# Altium schematic sheet STMF1.SchDoc
size A; SheetNumber: 2; SheetTotal: 9
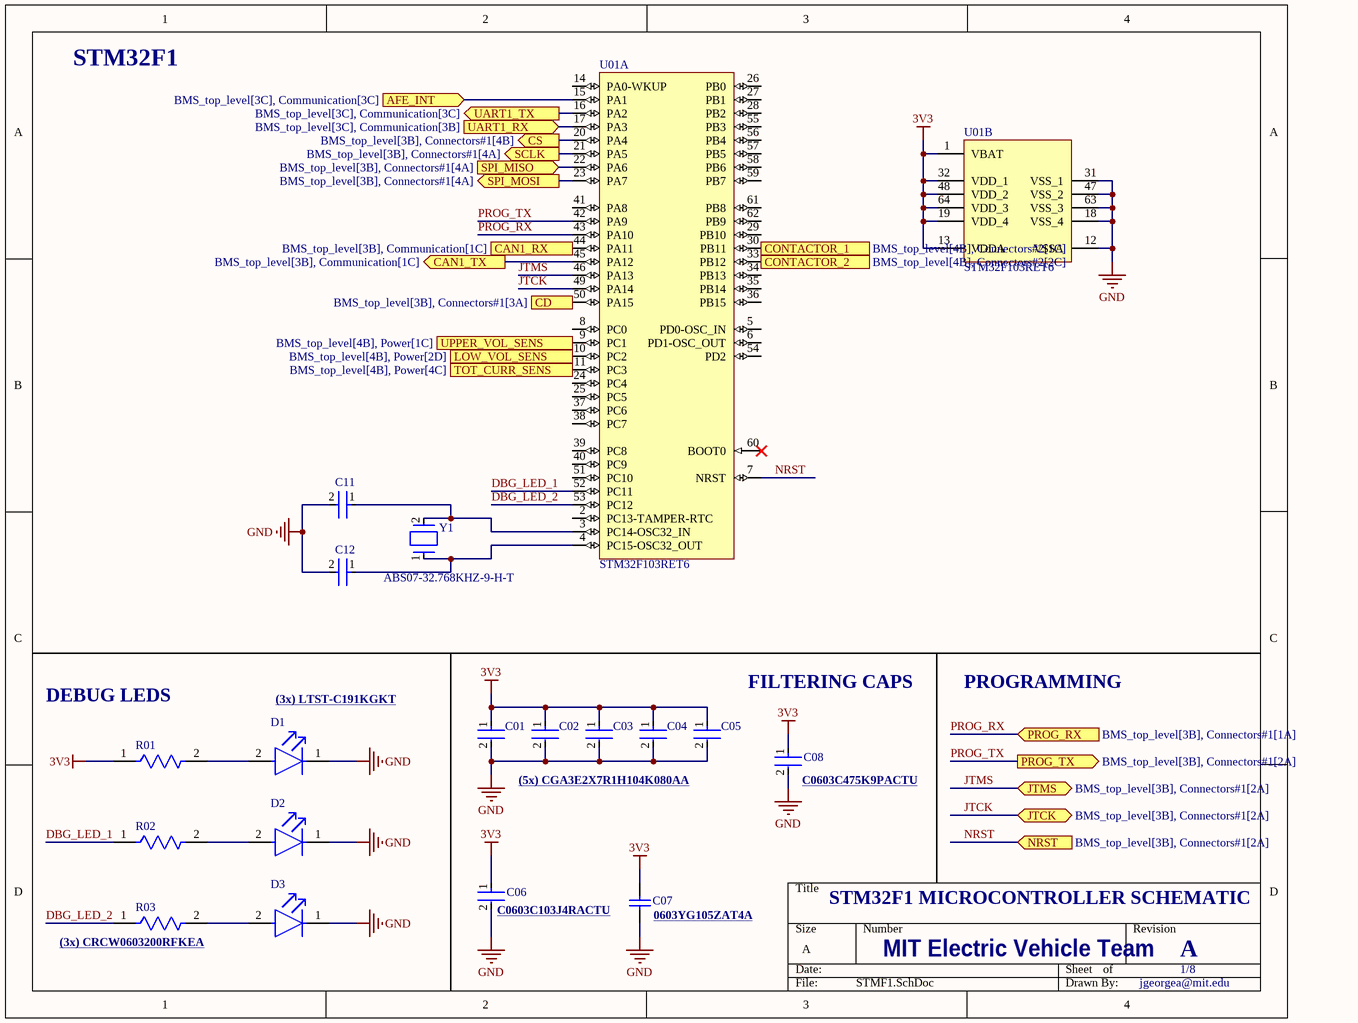
[diagram p0: STMF1.SchDoc]

## Parts
C01  CGA3E2X7R1H104K080AA  [FP-CGA3E-0_3-0_1-IPC_A]  (value not drawn)
C02  CGA3E2X7R1H104K080AA  [FP-CGA3E-0_3-0_1-IPC_A]  (value not drawn)
C03  CGA3E2X7R1H104K080AA  [FP-CGA3E-0_3-0_1-IPC_A]  (value not drawn)
C04  CGA3E2X7R1H104K080AA  [FP-CGA3E-0_3-0_1-IPC_A]  (value not drawn)
C05  CGA3E2X7R1H104K080AA  [FP-CGA3E-0_3-0_1-IPC_A]  (value not drawn)
C06  C0603C103J4RACTU  [FP-C0603C-CF-MFG]  (value not drawn)
C07  0603YG105ZAT4A  [CAPC1608X90X35ML15T15]  (value not drawn)
C08  C0603C475K9PACTU  [FP-C0603-CG-MFG]  (value not drawn)
C11  CBR06C409A1GAC  [FP-CBR06C-MFG]  (value not drawn)
C12  CBR06C409A1GAC  [FP-CBR06C-MFG]  (value not drawn)
D1  LTST-C191KGKT  [FP-LTST-C191KGKT-MFG]  (value not drawn)
D2  LTST-C191KGKT  [FP-LTST-C191KGKT-MFG]  (value not drawn)
D3  LTST-C191KGKT  [FP-LTST-C191KGKT-MFG]  (value not drawn)
R01  CRCW0603200RFKEA  [FP-CRCW0603-e3-MFG]  (value not drawn)
R02  CRCW0603200RFKEA  [FP-CRCW0603-e3-MFG]  (value not drawn)
R03  CRCW0603200RFKEA  [FP-CRCW0603-e3-MFG]  (value not drawn)
U01  STM32F103RET6  [STM-LQFP64_L]  (parts A,B of 2)
Y1  ABS07-32.768KHZ-9-H-T  [FP-ABS07-MFG]

## Ports
AFE_INT (in, see BMS_top_level[3C], Communication[3C]), CAN1_RX (in, see BMS_top_level[3B], Communication[1C]), CAN1_TX (out, see BMS_top_level[3B], Communication[1C]), CD (in, see BMS_top_level[3B], Connectors#1[3A]), CONTACTOR_1 (see BMS_top_level[4B], Connectors#2[1C]), CONTACTOR_2 (see BMS_top_level[4B], Connectors#2[2C]), CS (out, see BMS_top_level[3B], Connectors#1[4B]), JTCK (bidir, see BMS_top_level[3B], Connectors#1[2A]), JTMS (bidir, see BMS_top_level[3B], Connectors#1[2A]), LOW_VOL_SENS (in, see BMS_top_level[4B], Power[2D]), NRST (in, see BMS_top_level[3B], Connectors#1[2A]), PROG_RX (in, see BMS_top_level[3B], Connectors#1[1A]), PROG_TX (out, see BMS_top_level[3B], Connectors#1[2A]), SCLK (out, see BMS_top_level[3B], Connectors#1[4A]), SPI_MISO (in, see BMS_top_level[3B], Connectors#1[4A]), SPI_MOSI (out, see BMS_top_level[3B], Connectors#1[4A]), TOT_CURR_SENS (in, see BMS_top_level[4B], Power[4C]), UART1_RX (in, see BMS_top_level[3C], Communication[3B]), UART1_TX (out, see BMS_top_level[3C], Communication[3C]), UPPER_VOL_SENS (in, see BMS_top_level[4B], Power[1C])

## Nets
3V3: C01.1 C02.1 C03.1 C04.1 C05.1 C06.1 C07.2 C08.1 R01.1 U01.1(VBAT) U01.13(VDDA) U01.19(VDD_4) U01.32(VDD_1) U01.48(VDD_2) U01.64(VDD_3)
GND: C01.2 C02.2 C03.2 C04.2 C05.2 C06.2 C07.1 C08.2 C11.2 C12.2 D1.1(C) D2.1(C) D3.1(C) U01.12(VSSA) U01.18(VSS_4) U01.31(VSS_1) U01.47(VSS_2) U01.63(VSS_3)
AFE_INT: U01.15(PA1) ; port AFE_INT
CAN1_RX: U01.44(PA11) ; port CAN1_RX
CAN1_TX: U01.45(PA12) ; port CAN1_TX
CD: U01.50(PA15) ; port CD
CONTACTOR_1: U01.30(PB11) ; port CONTACTOR_1
CONTACTOR_2: U01.33(PB12) ; port CONTACTOR_2
CS: U01.20(PA4) ; port CS
DBG_LED_1: R02.1 U01.52(PC11)
DBG_LED_2: R03.1 U01.53(PC12)
JTCK: U01.49(PA14) ; port JTCK
JTMS: U01.46(PA13) ; port JTMS
LOW_VOL_SENS: U01.10(PC2) ; port LOW_VOL_SENS
NRST: U01.7(NRST) ; port NRST
PROG_RX: U01.43(PA10) ; port PROG_RX
PROG_TX: U01.42(PA9) ; port PROG_TX
SCLK: U01.21(PA5) ; port SCLK
SPI_MISO: U01.22(PA6) ; port SPI_MISO
SPI_MOSI: U01.23(PA7) ; port SPI_MOSI
TOT_CURR_SENS: U01.11(PC3) ; port TOT_CURR_SENS
UART1_RX: U01.17(PA3) ; port UART1_RX
UART1_TX: U01.16(PA2) ; port UART1_TX
UPPER_VOL_SENS: U01.9(PC1) ; port UPPER_VOL_SENS
NetC11_1: C11.1 U01.3(PC14-OSC32_IN) Y1.2
NetC12_1: C12.1 U01.4(PC15-OSC32_OUT) Y1.1
NetD1_2: D1.2(A) R01.2
NetD2_2: D2.2(A) R02.2
NetD3_2: D3.2(A) R03.2

Not connected (* = marked no-connect by the designer): U01 2(PC13-TAMPER-RTC) 5(PD0-OSC_IN) 6(PD1-OSC_OUT) 8(PC0) 14(PA0-WKUP) 24(PC4) 25(PC5) 26(PB0) 27(PB1) 28(PB2) 29(PB10) 34(PB13) 35(PB14) 36(PB15) 37(PC6) 38(PC7) 39(PC8) 40(PC9) 41(PA8) 51(PC10) 54(PD2) 55(PB3) 56(PB4) 57(PB5) 58(PB6) 59(PB7) 60(BOOT0)* 61(PB8) 62(PB9)

## Notes on the sheet
- STM32F1
- DEBUG LEDS
- (3x) LTST-C191KGKT
- FILTERING CAPS
- PROGRAMMING
- (5x) CGA3E2X7R1H104K080AA
- (near C08) C0603C475K9PACTU
- STM32F1 MICROCONTROLLER SCHEMATIC
- (near R03) (3x) CRCW0603200RFKEA
- (near C06) C0603C103J4RACTU
- (near C07) 0603YG105ZAT4A
- MIT Electric Vehicle Team
- A
- 1/8
- jgeorgea@mit.edu

## Library data of the parts
C01 C02 C03 C04 C05 = CMP-2000-07546-2: Cap Ceramic 100nF 50V X7R 10% Pad SMD 0603 +125°C Automotive T/R; Weight: 7.1E-05oz; Composition: Ceramic; Max Operating Temperature: 125°C; Termination: SMD/SMT; Dielectric: X7R; Length: 1.6mm; Package Quantity: 1; REACH SVHC: No SVHC; Lead Free: Lead Free; Case Code (Metric): 1608; Min Operating Temperature: -55°C; Packaging: Tape and Reel; Tolerance: 10%; Voltage Rating: 50V; Case Code (Imperial): 0603; Capacitance: 100nF; Case/Package: 0603; Voltage Rating (DC): 50V; Depth: 0.8mm; Radiation Hardening: No; Ratings: AEC-Q200; Mount: Surface Mount; Voltage: 50V; Thickness: 0.035inch; Width: 0.8mm; Height: 0.8mm
C06 = CMP-2006-03033-2: CAP CER 10000PF 16V 5% X7R 0603; Manufacturer: KEMET; Value: 10,000 pF; Tolerance: 0.05; Material: Ceramic; Temperature Coefficient: 30ppm/°C; Automotive Grade: Grade 1; Height: 0.87mm; Temperature Range High: +125°C; Temperature Range Low: -55°C; Automotive: Yes; Package: C0603C-CF; Temperature Characteristic: X7R; RoHS: TRUE; Device Class L2: Capacitors; Device Class L3: Ceramic Capacitors; Device Class L1: Passive Components; Manufacturer Part Number: C0603C103J4RACTU; Voltage Rating: 16 V; ComponentLink2URL: https://api.kemet.com/component-edge/download/datasheet/C0603C100J5GACAUTO.pdf; ComponentLink2Description: Datasheet; Mouser Description: Multilayer Ceramic Capacitors MLCC - SMD/SMT 16volts 10000pF X7R 5%; Temperature: -55°C to +125°C; Digikey Description: CAP CER 10000PF 16V 5% X7R 0603; Octopart: https://octopart.com/c0603c103j4ractu-kemet-9139447; Capacitance: 10,000 pF; Category: Cap; Lead Free: Yes
C07 = CMP-2006-04543-1: Manufacturer: AVX Interconnect / Elco; Part Number: 0603YG105ZAT4A
C08 = CMP-2006-02256-2: CAP CER 4.7UF 6.3V X5R 0603; Manufacturer: Kemet; Temperature Coefficient: 15%; Tolerance: 10%; Material: Ceramic; Device Class L3: Ceramic Capacitors; RoHS: TRUE; Value: 4.7uF; Lead Free: Yes; ComponentLink2Description: Datasheet; Mouser Description: Multilayer Ceramic Capacitors MLCC - SMD/SMT 6.3volts 4.7uF X5R 10%; Package: C0603-CG; Digikey Description: CAP CER 4.7UF 6.3V X5R 0603; ComponentLink2URL: https://content.kemet.com/datasheets/KEM_C1006_X5R_SMD.pdf; Category: Cap; Temperature Range Low: -55°C; Capacitance: 4.7uF; Temperature: -55°C to +85°C; Octopart: https://octopart.com/c0603c475k9pactu-kemet-104242; Ipc Land Pattern Name: CAPC16080X80; Voltage Rating: 6.3V; Temperature Range High: +85°C; Height: 0.9mm; Temperature Characteristic: X5R; Device Class L1: Passive Components; Manufacturer Part Number: C0603C475K9PACTU; Automotive: No; Device Class L2: Capacitors
C11 C12 = CMP-03020-005801-1: CAP CER 4PF 100V NP0 0603; Manufacturer: KEMET; Temperature Coefficient: 30ppm/°C; Material: Ceramic; Value: 4.0 pF; Temperature Characteristic: C0G; Tolerance: 0.05 pF; Automotive: No; Temperature Range Low: -55°C; Package: CBR06C; Ipc Land Pattern Name: CAPC16080X80; Temperature: -55°C to +125°C; Device Class L2: Capacitors; RoHS: TRUE; Device Class L1: Passive Components; Mouser Description: Multilayer Ceramic Capacitors MLCC - SMD/SMT 4pF 100volts; Temperature Range High: +125°C; Height: 0.87mm; ComponentLink2URL: https://content.kemet.com/datasheets/KEM_C1030_CBR_SMD.pdf; Octopart: https://octopart.com/cbr06c409a1gac-kemet-23801648; Device Class L3: Ceramic Capacitors; Lead Free: Yes; Manufacturer Part Number: CBR06C409A1GAC; Voltage Rating: 100 V; Category: Cap; Capacitance: 4.0 pF; Digikey Description: CAP CER 4PF 100V NP0 0603; ComponentLink2Description: Datasheet
D1-D3 = CMP-2000-05198-2: LED GREEN CLEAR SMD; Max Power Dissipation: 75mW; Forward Current: 30mA; Reverse Voltage: 5V; Lens Color: Colorless; Forward Voltage: 2V; Dominant Wavelength: 571nm; Number of LEDs: 1; Viewing Angle: 130°; Lens Style: Rectangular; Test Current: 20mA; Luminous Intensity: 35mcd; Wavelength: 574nm; Width: 0.8mm; Case Code (Imperial): 0603; Number of Pins: 2; Lead Free: Lead Free; Packaging: Tape and Reel; Package Quantity: 1; Min Operating Temperature: -55°C; Case/Package: 0603; Length: 1.6mm; Power Dissipation: 75mW; Depth: 0.8mm; Radiation Hardening: No; Mount: Surface Mount; Max Operating Temperature: 85°C; Color: Green; Power Rating: 75mW; Height: 0.55mm; Illumination Color: Green; Case Code (Metric): 1608; Lens Transparency: Clear; Number of Elements: 1
R01 R02 R03 = CMP-2000-03062-2: RES Thick Film, 200Ω, 1%, 0.1W, 100ppm/°C, 0603; Power Rating: 100mW; Voltage Rating (DC): 75V; Resistance: 200R; Military Standard: Not; Tolerance: 1%; Lead Free: Lead Free; Case Code (Imperial): 0603; Depth: 0.85mm; Max Operating Temperature: 155°C; Contact Plating: Tin; Length: 1.55mm; Weight: 7.1E-05oz; Voltage Rating: 75V; Height: 0.45mm; Min Operating Temperature: -55°C; Case/Package: 0603; Number of Pins: 2; Composition: Thick Film; Termination: SMD/SMT; Case Code (Metric): 1608; Width: 0.85mm; Package Quantity: 5000; Temperature Coefficient: 100ppm/°C; Packaging: Tape and Reel
U01 = CMP-0237-00201-3: ARM Cortex-M3 32-bit MCU, 512 KB Flash, 64 KB Internal RAM, 51 I/Os, 64-pin LQFP, -40 to 85 degC, Tray; FLASH Size (Prog) (kB): 512; Internal RAM Size (kB): 64; A/D Converter: 3x12-bit (16 Channel); I/Os (High Current): 51; Supply Voltage(Vcc) min (V): 2; D/A Converter: 2x12-bit (2 Channel); Operating Frequency(F) (Processor speed) (MHz): 72; PackageDescription: 64-Pin Low Profile Quad Flat Package, 10 x 10 mm Body, 0.5 mm Pitch; ComponentLink3URL: http://www.st.com/st-web-ui/static/active/en/resource/technical/document/datasheet/DM00037051.pdf; DatasheetVersion: Rev. 8; Packing: Tray; PackageReference: LQFP64; ComponentLink3Description: Package Specification; Core: ARM Cortex-M3; Mounting Technology: Surface Mount; PartNumber: STM32F103RET6; PackageVersion: Rev. 4, 06/2013; ComponentLink1URL: http://www.st.com/web/en/home.html; ComponentLink1Description: Manufacturer URL; ComponentLink2Description: Datasheet; ComponentLink2URL: http://www.st.com/st-web-ui/static/active/en/resource/technical/document/datasheet/CD00191185.pdf
Y1 = CMP-27762-015610-1: Crystal 32.768kHz ±20ppm (Tol) 9pF FUND 70kΩ 2-Pin CSMD T/R; RoHS Compliant: Yes